# EAGLE design TCS3414_v0 (EAGLE 6.6.0)
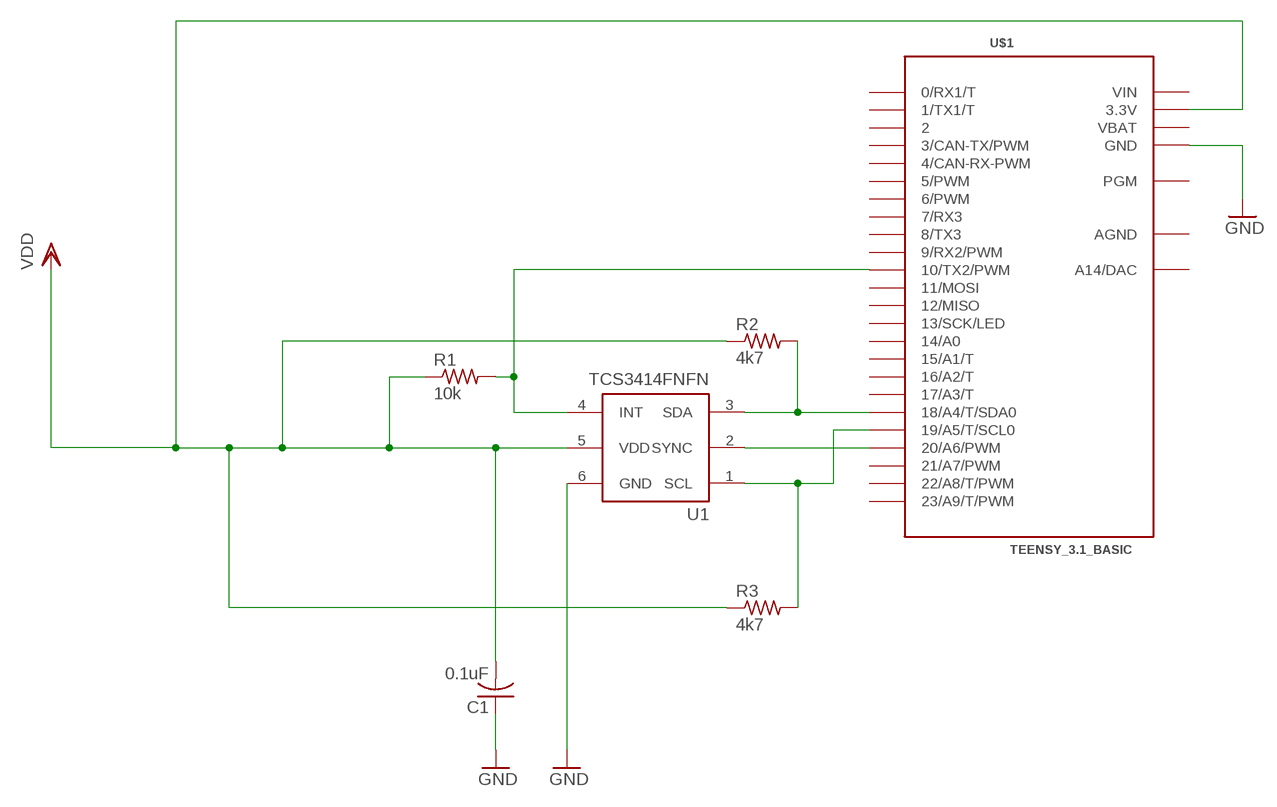
[diagram p0: schematic, sheet 1]

## Parts
C1  0.1uF  C-USC0603  [C0603]
R1  10k  R-US_R0603  [R0603]
R2  4k7  R-US_R0603  [R0603]
R3  4k7  R-US_R0603  [R0603]
U1  TCS3414FNFN  [TCS3414FN]
U$1  TEENSY_3.1_BASIC  [TEENSY_3.1_BASIC]

## Nets
GND: C1.1 U1.6(GND) U$1.GND U$1.GND1(GND)
N$1: R1.2 U1.4(INT) U$1.10(10/TX2/PWM)
N$2: R2.2 U1.3(SDA) U$1.18/A4(18/A4/T/SDA0)
N$3: R3.2 U1.1(SCL) U$1.19/A5(19/A5/T/SCL0)
N$4: U1.2(SYNC) U$1.20/A6(20/A6/PWM)
VDD: C1.2 R1.1 R2.1 R3.1 U1.5(VDD) U$1.3.3V U$1.3.3V1(3.3V)
Unconnected: U$1.0(0/RX1/T) U$1.1(1/TX1/T) U$1.2 U$1.3(3/CAN-TX/PWM) U$1.4(4/CAN-RX-PWM) U$1.5(5/PWM) U$1.6(6/PWM) U$1.7(7/RX3) U$1.8(8/TX3) U$1.9(9/RX2/PWM) U$1.11(11/MOSI) U$1.12(12/MISO) U$1.13(13/SCK/LED) U$1.14/A0 U$1.15/A1(15/A1/T) U$1.16/A2(16/A2/T) U$1.17/A3(17/A3/T) U$1.21/A7(21/A7/PWM) U$1.22/A8(22/A8/T/PWM) U$1.23/A9(23/A9/T/PWM) U$1.A14(A14/DAC) U$1.PGM

## Power pins joined to a net without a drawn wire
AGND: U$1.AGND
VBAT: U$1.VBAT
VIN: U$1.VIN

## Library data of the parts
C1 = resistor:C-US: CAPACITOR, American symbol
R1-R3 = rcl:R-US_: RESISTOR, American symbol
U1 = TCS3414FN:TCS3414FN
U$1 = mcu-accessories:TEENSY_3.1_BASIC: Footprint for Teensy 3.1 board using all pin connections on the outer perimeter

## Net classes
0 default: width 0.254 mm, clearance 0.254 mm

## Board
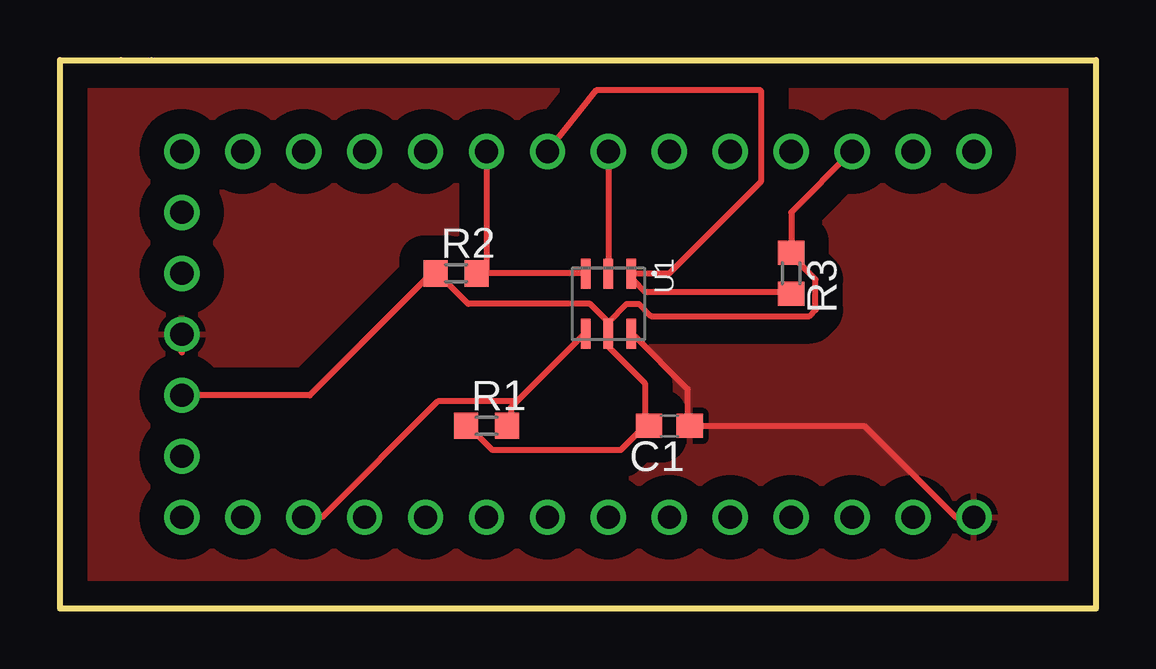
[diagram p1: board, top side]
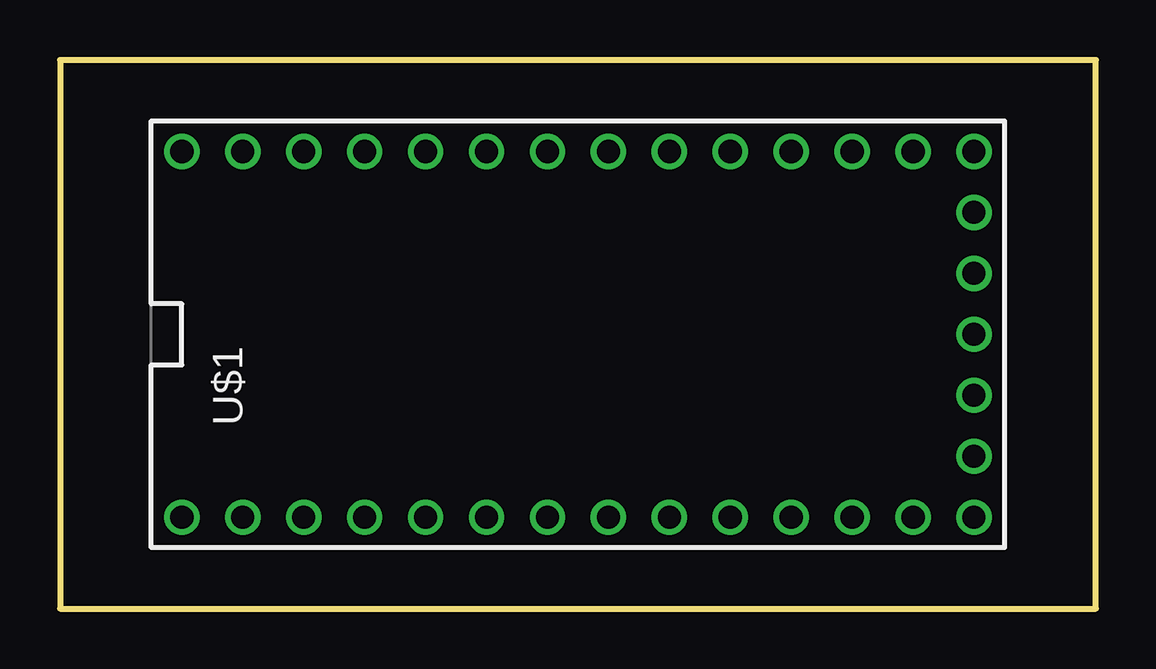
[diagram p2: board, bottom side, seen from below]

Size 43.18 x 22.86 mm. Coordinates in mm from the lower left corner, seen from the top.
Outline: 2.54,22.86 3.81,22.86 43.18,22.86 43.18,0 0,0 0,22.86 2.54,22.86
Copper layers (1*16): Top 0.035mm / dielectric 1.5mm / Bottom 0.035mm
Design rules "default": minimum track width 10mil, minimum drill 24mil, track to track 8mil, track to pad 8mil, pad to pad 8mil, via to via 8mil, smd to smd 8mil, copper to edge 40mil, drill to drill 8mil, minimum pad ring 10mil, minimum via ring 8mil, stop-mask expansion 4mil, vias tented up to drill 0mil, thermal gap 10mil

### Footprints (pad centres in the part's own frame; a part is rotated, then mirrored left to right if it is on the bottom)
C0603 = smd 1.1 x 1: 1 -0.85,0; 2 0.85,0
R0603 = smd 1 x 1.1: 1 -0.85,0; 2 0.85,0
TCS3414FN = smd 1.25 x 0.4: 1 -1.25,0.95; 2 -1.25,0; 3 -1.25,-0.95; 4 1.25,-0.95; 5 1.25,0; 6 1.25,0.95
TEENSY_3.1_BASIC = drill 0.965: 0 -7.62,13.97; 1 -7.62,11.43; 2 -7.62,8.89; 3 -7.62,6.35; 3.3V 7.62,11.43; 3.3V1 -2.54,-16.51; 4 -7.62,3.81; 5 -7.62,1.27; 6 -7.62,-1.27; 7 -7.62,-3.81; 8 -7.62,-6.35; 9 -7.62,-8.89; 10 -7.62,-11.43; 11 -7.62,-13.97; 12 -7.62,-16.51; 13 7.62,-16.51; 14/A0 7.62,-13.97; 15/A1 7.62,-11.43; 16/A2 7.62,-8.89; 17/A3 7.62,-6.35; 18/A4 7.62,-3.81; 19/A5 7.62,-1.27; 20/A6 7.62,1.27; 21/A7 7.62,3.81; 22/A8 7.62,6.35; 23/A9 7.62,8.89; A14 5.08,-16.51; AGND 7.62,13.97; GND -7.62,16.51; GND1 0,-16.51; PGM 2.54,-16.51; VBAT -5.08,-16.51; VIN 7.62,16.51

### Placement (x,y rotation side)
C1  25.4,7.62 180 top
R1  2k5  [R0603]  17.78,7.62 0 top
R2  1k3  [R0603]  16.51,13.97 0 top
R3  1k3  [R0603]  30.48,13.97 270 top
U1  22.86,12.7 270 top
U$1  21.59,11.43 90 bottom

### Tracks (layer width: path | path; a pad name or v marks a point on that pad's centre or on a via)
GND
  Top 0.254: U1.6 23.88,11.43 26.16,9.14 26.16,7.62 C1.1 33.53,7.62 37.34,3.81 U$1.GND | 5.08,10.67 U$1.GND1
  pour Top (isolate 1.016): 0.64,22.35 0.64,0.51 42.55,0.51 42.55,0.63 42.55,22.35
N$1
  Top 0.254: 19.05,8.64 21.84,11.43 U1.4 | 19.05,8.64 18.8,8.38 18.8,7.62 R1.2 | U$1.10 10.92,3.81 15.75,8.64 19.05,8.64
N$2
  Top 0.254: 17.78,13.97 21.84,13.97 U1.3 | U$1.18/A4 17.78,13.97 | 17.78,13.97 R2.2
N$3
  Top 0.254: R3.2 30.48,13.21 24.38,13.21 23.88,13.72 U1.1 23.88,13.97 25.4,13.97 29.21,17.78 29.21,21.59 22.35,21.59 U$1.19/A5
N$4
  Top 0.254: U$1.20/A6 U1.2
VDD
  Top 0.254: U$1.3.3V 30.48,16.51 R3.1 30.48,14.73 31.5,13.72 31.5,12.45 31.24,12.19 24.64,12.19 24.13,12.7 23.62,12.7 22.86,11.94 | 24.38,7.62 23.37,6.6 18.03,6.6 17.02,7.62 R1.1 | 22.86,11.94 22.1,12.7 17.02,12.7 15.75,13.97 R2.1 15.49,13.97 10.41,8.89 U$1.3.3V1 | U1.5 22.86,11.94 | 24.38,7.62 24.38,9.4 22.86,10.92 U1.5 | 24.38,7.62 C1.2 | 22.86,11.68 U1.5